# Altium project Compact Inverter Driver V5.PrjPcb (part 2 of 2)

## Sheet Voltage Sensor.SchDoc
size A4; SheetNumber: 7; SheetTotal: 9
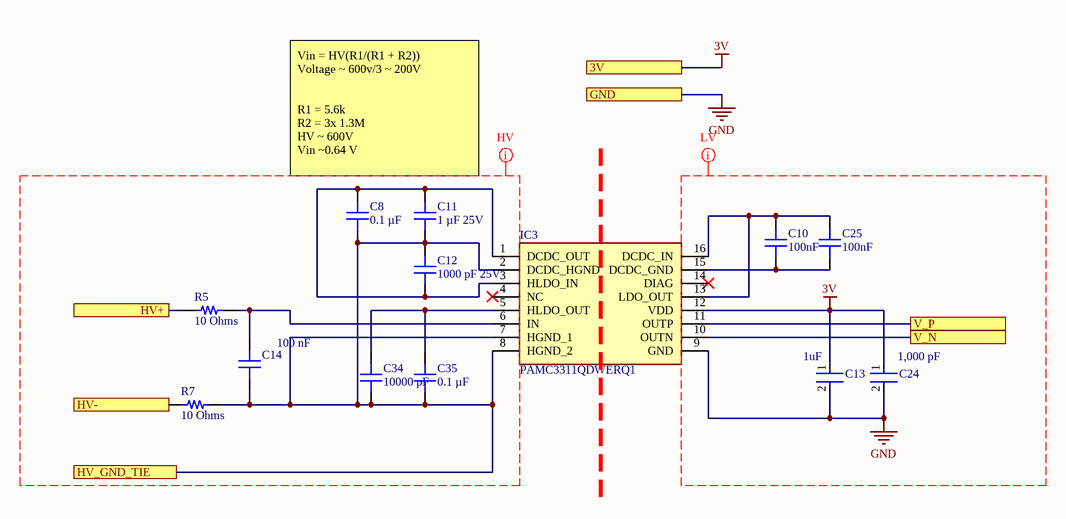
[diagram p6: Voltage Sensor.SchDoc]

### Parts
C8  0.1 µF  [CAP 0402_1005]
C10  100nF  [CAP 0402_1005]
C11  Capacitance: 1 µF 25V  [MURATA GRM155 0402_1005]  (hidden comment: 1 µF)
C12  Capacitance: 1000 pF 25V  [CAP 0402_1005]  (hidden comment: 1000 pF)
C13  Capacitance: 1uF  [FP-CGA3E-0_3-0_1-IPC_A]  (hidden comment: CGA3E1X7R1E105K080AC)
C14  100 nF  [CAP 0603_1608]
C24  Capacitance: 1,000 pF  [FP-C0603C-CF-MFG]  (hidden comment: C0603C102K5RACTU)
C25  100nF  [CAP 0402_1005]
C34  10000 pF  [CAP 0402_1005]
C35  0.1 µF  [CAP 0402_1005]
IC3  PAMC3311QDWERQ1  [SOIC127P1030X265-16N]
R5  10 Ohms  [RES 0402_1005]
R7  10 Ohms  [RES 0402_1005]

### Ports
3V, GND, HV+, HV-, HV_GND_TIE, V_N, V_P

### Nets
3V: C13.1 C24.1 IC3.12(VDD) ; port 3V
GND: C13.2 C24.2 IC3.9(GND) ; port GND
HV-: R7.1 ; port HV-
HV_SENSE: R5.1 ; port HV+
HV_TIE: C8.1 C11.1 C12.2 C14.1 C34.1 C35.1 IC3.2(DCDC_HGND) IC3.7(HGND_1) IC3.8(HGND_2) R7.2 ; port HV_GND_TIE
V_N: IC3.10(OUTN) ; port V_N
V_P: IC3.11(OUTP) ; port V_P
NetC8_2: C8.2 C11.2 C12.1 IC3.1(DCDC_OUT) IC3.3(HLDO_IN)
NetC10_1: C10.1 C25.1 IC3.15(DCDC_GND)
NetC10_2: C10.2 C25.2 IC3.13(LDO_OUT) IC3.16(DCDC_IN)
NetC14_2: C14.2 IC3.6(IN) R5.2
NetC34_2: C34.2 C35.2 IC3.5(HLDO_OUT)

Not connected (* = marked no-connect by the designer): IC3 4(NC)* 14(DIAG)*

### Layout directives
net class HV: (no net found under the mark)
net class LV: 3V, GND

### Notes on the sheet
- Vin = HV(R1/(R1 + R2))
  Voltage ~ 600v/3 ~ 200V
  R1 = 5.6k
  R2 = 3x 1.3M
  HV ~ 600V
  Vin ~0.64 V
  VinMax = +- 2v
  Vout = ~6.4v
- MY
- 25
- Project:
- Author
- Revision
- Sheet
- Modified
- of

### Library data of the parts
C8 C35 = C0402C104K4RECAUTO: CAP CER 0402 0.1UF 16V X7R 10%; manufacturer: KEMET; Part Number: C0402C104K4RECAUTO; Capacitance: 0.1 µF; Applications: Automotive, ESD Protection; componentlink1description: Datasheet; componentlink1url: https://api.kemet.com/component-edge/download/datasheet/C0402C104K4RECAUTO.pdf; componentlink2description: DigiKey Link; componentlink2url: https://www.digikey.com/en/products/detail/kemet/C0402C104K4RECAUTO/8563695; Device Package: 0402 (1005 Metric); lastupdated: 2/9/2024 8:04:38 PM; Lifecycle Status: Active; Minimum Order: 1; Mounting Type: Surface Mount, MLCC; Operating Temperature: -55°C ~ 125°C; Package / Case: 0402 (1005 Metric); packaging: TapeAndReel; partid: 1731; Part Status: Active; price: 0.01; Ratings: AEC-Q200; series: ESD SMD Auto X7R; Size / Dimension: 0.039" L x 0.020" W (1.00mm x 0.50mm); Supplier 1: DigiKey; Supplier Part Number 1: 399-17167-1-ND; Temperature Coefficient: X7R; Thickness (Max): 0.022" (0.55mm); Tolerance: ±10%; value: 0.1 µF; Voltage - Rated: 16V
C10 C25 = ZRB157R61E225KE11D: CAP CER 2.2UF 25V X5R 0402; manufacturer: Murata Electronics; Capacitance: 2.2 µF; Tolerance: ±10%; value: 2.2 µF; Part Number: ZRB157R61E225KE11D; Applications: Acoustic Noise Reduction; componentlink1description: Datasheet; componentlink1url: https://search.murata.co.jp/Ceramy/image/img/A01X/G101/ENG/ZRB157R61E225KE11-01.pdf; componentlink2description: DigiKey Link; componentlink2url: https://www.digikey.com/en/products/detail/murata-electronics/ZRB157R61E225KE11D/5321074; Device Package: 0402 (1005 Metric); Features: Interposer Termination; lastupdated: 2/9/2024 8:04:27 PM; Lifecycle Status: Active; Minimum Order: 1; Mounting Type: Surface Mount, MLCC; Operating Temperature: -55°C ~ 85°C; Package / Case: 0402 (1005 Metric); packaging: TapeAndReel; partid: 8590; Part Status: Active; price: 0.04; series: ZRB; Size / Dimension: 0.039" L x 0.020" W (1.00mm x 0.50mm); Supplier 1: DigiKey; Supplier Part Number 1: 490-10982-1-ND; Temperature Coefficient: X5R; Thickness (Max): 0.033" (0.85mm); Voltage - Rated: 25V
C11 = GRM155C71A105KE11D: CAP CER 1UF 10V X7S 0402; manufacturer: Murata Electronics; Tolerance: ±10%; Part Number: GRM155C71A105KE11D; Applications: General Purpose; componentlink1description: Datasheet; componentlink1url: https://search.murata.co.jp/Ceramy/image/img/A01X/G101/ENG/GRM155C71A105KE11-01.pdf; componentlink2description: DigiKey Link; componentlink2url: https://www.digikey.com/en/products/detail/murata-electronics/GRM155C71A105KE11D/6606086; Device Package: 0402 (1005 Metric); lastupdated: 7/23/2025 10:42:36 AM; Lifecycle Status: Active; Minimum Order: 1; Mounting Type: Surface Mount, MLCC; Operating Temperature: -55°C ~ 125°C; Package / Case: 0402 (1005 Metric); packaging: TapeAndReel; partid: 1749; Part Status: Active; price: 0.01; series: GRM; Size / Dimension: 0.039" L x 0.020" W (1.00mm x 0.50mm); Supplier 1: DigiKey; Supplier Part Number 1: 490-14457-1-ND; Temperature Coefficient: X7S; Thickness (Max): 0.024" (0.60mm); value: 1 µF; Voltage - Rated: 10V
C12 = UMK105CG102JVHF: CAP CER 1000PF 50V C0G/NP0 0402; manufacturer: Taiyo Yuden; Temperature Coefficient: C0G, NP0; Tolerance: ±5%; Part Number: UMK105CG102JVHF; Applications: Automotive; componentlink1description: Datasheet; componentlink1url: https://ds.yuden.co.jp/TYCOMPAS/ut/detail?pn=UMK105CG102JVHF &u=M; componentlink2description: DigiKey Link; componentlink2url: https://www.digikey.com/en/products/detail/taiyo-yuden/UMK105CG102JVHF/4811103; Device Package: 0402 (1005 Metric); lastupdated: 2/9/2024 8:04:38 PM; Lifecycle Status: Active; Minimum Order: 1; Mounting Type: Surface Mount, MLCC; Operating Temperature: -55°C ~ 125°C; Package / Case: 0402 (1005 Metric); packaging: TapeAndReel; partid: 1779; Part Status: Active; price: 0.01; Ratings: AEC-Q200; series: M; Size / Dimension: 0.039" L x 0.020" W (1.00mm x 0.50mm); Supplier 1: DigiKey; Supplier Part Number 1: 587-3737-1-ND; Thickness (Max): 0.022" (0.55mm); value: 1000 pF; Voltage - Rated: 50V
C13 = CMP-08246-001507-1: Cap Ceramic 1uF 25V X7R 10% Pad SMD 0603 +125°C Automotive T/R; Dielectric: X7R; Voltage Rating: 25V; Thickness: 0.035inch; Width: 0.031inch; Ratings: AEC-Q200; Case Code (Metric): 1608; REACH SVHC: No SVHC; Voltage: 25V; Composition: Ceramic; Min Operating Temperature: -55°C; Termination: SMD/SMT; Depth: 0.8mm; Max Operating Temperature: 125°C; Mount: Surface Mount; Weight: 7.1E-05oz; Package Quantity: 4000; Tolerance: 10%; Packaging: Tape and Reel; Lead Free: Lead Free; Case/Package: 0603; Length: 1.6mm; Height: 0.8mm; Case Code (Imperial): 0603; Voltage Rating (DC): 25V
C14 = VJ0603Y104MXQCW1BC: manufacturer: Vishay Vitramon; Capacitance: 0.1 µF; Temperature Coefficient: X7R; Tolerance: ±20%; value: 0.1 µF; Voltage - Rated: 10V; Part Number: VJ0603Y104MXQCW1BC; Applications: General Purpose; componentlink1description: Datasheet; componentlink1url: https://www.vishay.com/docs/28548/vjw1bcbascomseries.pdf; componentlink2description: DigiKey Link; componentlink2url: https://www.digikey.com/en/products/detail/vishay-vitramon/VJ0603Y104MXQCW1BC/8305323; Device Package: 0603 (1608 Metric); lastupdated: 2/9/2024 8:09:54 PM; Lifecycle Status: Active; Minimum Order: 1; Mounting Type: Surface Mount, MLCC; Operating Temperature: -55°C ~ 125°C; Package / Case: 0603 (1608 Metric); packaging: TapeAndReel; partid: 34594; Part Status: Active; price: 0.01; series: VJ W1BC; Size / Dimension: 0.063" L x 0.031" W (1.60mm x 0.80mm); Supplier 1: DigiKey; Supplier Part Number 1: 720-VJ0603Y104MXQCW1BCCT-ND; Thickness (Max): 0.034" (0.87mm)
C24 = CMP-2006-03022-3: CAP CER 1000PF 50V X7R 0603; Manufacturer: KEMET; Automotive Grade: Grade 1; Tolerance: 0.1; Value: 1,000 pF; Temperature Coefficient: 30ppm/°C; Material: Ceramic; Temperature Characteristic: X7R; ComponentLink2URL: https://api.kemet.com/component-edge/download/datasheet/C0603C100J5GACAUTO.pdf; Temperature Range Low: -55°C; Device Class L2: Capacitors; Device Class L3: Ceramic Capacitors; Device Class L1: Passive Components; Temperature Range High: +125°C; Manufacturer Part Number: C0603C102K5RACTU; Digikey Description: CAP CER 1000PF 50V X7R 0603; Temperature: -55°C to +125°C; Voltage Rating: 50 V; Mouser Description: Capacitor; Ceramic; Cap; 1000pF; Tol 10%; SMT; Vol-Rtg 50V; X7R; Tape and Reel; Automotive: Yes; RoHS: TRUE; Octopart: https://octopart.com/c0603c102k5ractu-kemet-144878; Height: 0.87mm; Package: C0603C-CF; Lead Free: Yes; Category: Cap; ComponentLink2Description: Datasheet
C34 = TMK105BJ103KP-F: CAP CER 10000PF 25V X5R 0402; manufacturer: Taiyo Yuden; Tolerance: ±10%; Part Number: TMK105BJ103KP-F; Capacitance: 10000 pF; Applications: SMPS Filtering; componentlink1description: Datasheet; componentlink1url: https://ds.yuden.co.jp/TYCOMPAS/ut/detail?pn=TMK105BJ103KP-F  &u=M; componentlink2description: DigiKey Link; componentlink2url: https://www.digikey.com/en/products/detail/taiyo-yuden/TMK105BJ103KP-F/5182051; Device Package: 0402 (1005 Metric); lastupdated: 2/9/2024 8:04:38 PM; Lifecycle Status: Active; Minimum Order: 1; Mounting Type: Surface Mount, MLCC; Operating Temperature: -55°C ~ 85°C; Package / Case: 0402 (1005 Metric); packaging: TapeAndReel; partid: 1788; Part Status: Active; price: 0.01; series: M; Size / Dimension: 0.039" L x 0.020" W (1.00mm x 0.50mm); Supplier 1: DigiKey; Supplier Part Number 1: 587-5593-1-ND; Temperature Coefficient: X5R; Thickness (Max): 0.022" (0.55mm); value: 10000 pF; Voltage - Rated: 25V
IC3 = PAMC3311QDWERQ1: Integrated Circuit; Manufacturer_Name: Texas Instruments; Datasheet Link: https://www.ti.com/lit/gpn/amc3311-q1?HQS=ti-null-null-sf-df-pf-sep-wwe&DCM=yes?hkey=EF798316E3902B6ED9A73243A3159BB0; Height: 2.65mm; Manufacturer_Part_Number: PAMC3311QDWERQ1
R5 R7 = WR04X100 JTL: RES 10 OHM 5% 1/16W 0402; Manufacturer: Walsin Technology Corporation; Power (Watts): 0.063W, 1/16W; Temperature Coefficient: -200/ +400ppm/°C; Part Number: WR04X100 JTL; Value: 10 Ohms; ComponentLink1Description: Datasheet; ComponentLink1URL: https://www.passivecomponent.com/wp-content/uploads/chipR/ASC_WR.pdf; ComponentLink2Description: DigiKey Link; ComponentLink2URL: https://www.digikey.com/en/products/detail/walsin-technology-corporation/WR04X100-JTL/13241174; Composition: Thick Film; Device Package: 0402 (1005 Metric); Height - Seated (Max): 0.016" (0.40mm); LastUpdated: 2/9/2024 8:28:55 PM; Lifecycle Status: Active; Minimum Order: 1; Number of Terminations: 2; Operating Temperature: -55°C ~ 155°C; Package / Case: 0402 (1005 Metric); Packaging: CutTape; PartId: 64776; Part Status: Active; Price: 0.01; Resistance: 10 Ohms; Series: WR; Size / Dimension: 0.039" L x 0.020" W (1.00mm x 0.50mm); Supplier 1: DigiKey; Supplier Part Number 1: 1292-WR04X100JTLCT-ND; Supplier Device Package: 0402; Tolerance: ±5%

## Sheet LED.SchDoc
size A; SheetNumber: 9; SheetTotal: 9
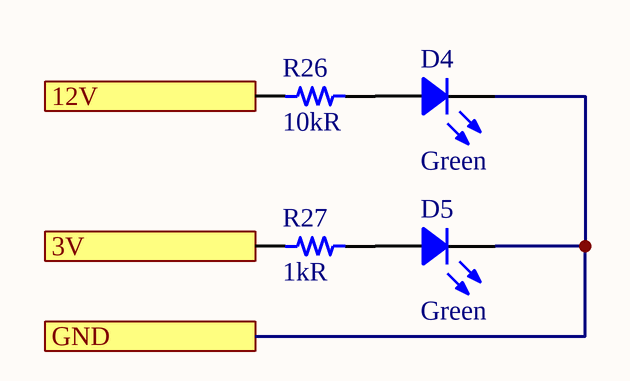
[diagram p7: LED.SchDoc]

### Parts
D4  Green  [LED 0603_1608 GREEN]
D5  Green  [LED 0603_1608 GREEN]
R26  10kR  [RES 0402_1005]
R27  1kR  [RES 0402_1005]

### Ports
3V, 12V, GND

### Nets
3V: R27.2 ; port 3V
12V: R26.2 ; port 12V
GND: D4.2 D5.2 ; port GND
NetD4_1: D4.1 R26.1
NetD5_1: D5.1 R27.1

### Library data of the parts
D4 D5 = SECU1413C-TG20: GREEN, D=564NM, IV=75MCD; Manufacturer: Sanken; Current - Test: 20mA; Lens Size: 0.92mm Dia; Lens Style: Round with Domed Top; Millicandela Rating: 75mcd; Viewing Angle: 60°; Voltage - Forward (Vf) (Typ): 2.1V; Wavelength - Dominant: 564nm; Part Number: SECU1413C-TG20; Color: Green; ComponentLink1Description: Datasheet; ComponentLink1URL: https://www.semicon.sanken-ele.co.jp/sk_content/secu1413c-tg20_ds_en.pdf; ComponentLink2Description: DigiKey Link; ComponentLink2URL: https://www.digikey.com/en/products/detail/sanken/SECU1413C-TG20/16639358; Device Package: 0603 (1608 Metric); Height (Max): 1.48mm; LastUpdated: 6/3/2024 7:58:48 PM; Lifecycle Status: Active; Minimum Order: 1; Mounting Type: Surface Mount; Package / Case: 0603 (1608 Metric); Packaging: CutTape; PartId: 1166; Part Status: Active; Price: 0.28; Series: -; Size / Dimension: 1.60mm L x 0.80mm W; Supplier 1: DigiKey; Supplier Part Number 1: 1261-SECU1413C-TG20TR-ND; Supplier Device Package: 0603; Value: Green
R26 R27 = RP73PF1E249KBTD: RES 249K OHM 0.1% 1/10W 0402; Manufacturer: TE Connectivity Passive Product; Value: 249 kOhms; Power (Watts): 0.1W, 1/10W; Temperature Coefficient: ±25ppm/°C; Part Number: RP73PF1E249KBTD; ComponentLink1Description: Datasheet; ComponentLink1URL: https://www.te.com/commerce/DocumentDelivery/DDEController?Action=srchrtrv&DocNm=1773272&DocType=DS&DocLang=English; ComponentLink2Description: DigiKey Link; ComponentLink2URL: https://www.digikey.com/en/products/detail/te-connectivity-passive-product/RP73PF1E249KBTD/8261091; Composition: Thin Film; Device Package: 0402 (1005 Metric); Height - Seated (Max): 0.014" (0.35mm); LastUpdated: 2/9/2024 8:30:24 PM; Lifecycle Status: Active; Minimum Order: 1; Number of Terminations: 2; Operating Temperature: -55°C ~ 155°C; Package / Case: 0402 (1005 Metric); Packaging: TapeAndReel; PartId: 2418; Part Status: Active; Price: 0.07; Resistance: 249 kOhms; Series: RP73, Holsworthy; Size / Dimension: 0.039" L x 0.020" W (1.00mm x 0.50mm); Supplier 1: DigiKey; Supplier Part Number 1: A127549CT-ND; Supplier Device Package: 0402; Tolerance: ±0.1%

## Nets that join several sheets
3V: U_DriverA (C9_U_DriverA.2 IC2_U_DriverA.3 IC2_U_DriverA.8 U1_U_DriverA.5), U_Bias_HighA (C1_U_Bias_HighA.2 R1_U_Bias_HighA.2 R22_U_Bias_HighA.1), U_HallConnectorA (J1_U_HallConnectorA.4 R18_U_HallConnectorA.1), Output Connector (6 pins), U_DriverB (C9_U_DriverB.2 IC2_U_DriverB.3 IC2_U_DriverB.8 U1_U_DriverB.5), U_Bias_HighB (C1_U_Bias_HighB.2 R1_U_Bias_HighB.2 R22_U_Bias_HighB.1), U_HallConnectorB (J1_U_HallConnectorB.4 R18_U_HallConnectorB.1), U_DriverC (C9_U_DriverC.2 IC2_U_DriverC.3 IC2_U_DriverC.8 U1_U_DriverC.5), U_Bias_HighC (C1_U_Bias_HighC.2 R1_U_Bias_HighC.2 R22_U_Bias_HighC.1), U_HallConnectorC (J1_U_HallConnectorC.4 R18_U_HallConnectorC.1), Voltage Sensor (C13.1 C24.1 IC3.12), LED (R27.2)
12V: U_Bias_HighA (5 pins), Output Connector (J3.25 J3.27), U_Bias_HighB (5 pins), U_Bias_HighC (5 pins), LED (R26.2)
GND: Tree (10 pins), U_DriverA (8 pins), U_Bias_HighA (18 pins), U_HallConnectorA (J1_U_HallConnectorA.1), Output Connector (13 pins), U_DriverB (8 pins), U_Bias_HighB (18 pins), U_HallConnectorB (J1_U_HallConnectorB.1), U_DriverC (8 pins), U_Bias_HighC (18 pins), U_HallConnectorC (J1_U_HallConnectorC.1), Voltage Sensor (C13.2 C24.2 IC3.9), LED (D4.2 D5.2)
FAULT: U_Bias_HighA (IC1_U_Bias_HighA.3 R22_U_Bias_HighA.2), Output Connector (R19.1)
FAULT: Output Connector (R21.1), U_Bias_HighC (IC1_U_Bias_HighC.3 R22_U_Bias_HighC.2)
FAULT: Output Connector (R20.1), U_Bias_HighB (IC1_U_Bias_HighB.3 R22_U_Bias_HighB.2)
HV-: Voltage Sensor (R7.1), U_Gate Connector (J2_U_Gate_Connector.01)
HV_SENSE: Voltage Sensor (R5.1), U_Gate Connector (J2_U_Gate_Connector.02)
HV_TIE: U_DriverC (C19_U_DriverC.2 C21_U_DriverC.1 IC2_U_DriverC.9 R16_U_DriverC.2), U_Bias_HighC (18 pins), U_Gate ConnectorCB (J2_U_Gate_ConnectorCB.01), Voltage Sensor (10 pins)
J+: U_DriverA (D3_U_DriverA.2 R16_U_DriverA.1 R17_U_DriverA.2), U_Gate ConnectorAB (J2_U_Gate_ConnectorAB.02)
J+: U_DriverA (D2_U_DriverA.2 R4_U_DriverA.1 R9_U_DriverA.2), U_Gate ConnectorAA (J2_U_Gate_ConnectorAA.02)
J+: U_DriverB (D3_U_DriverB.2 R16_U_DriverB.1 R17_U_DriverB.2), U_Gate ConnectorBB (J2_U_Gate_ConnectorBB.02)
J+: U_DriverB (D2_U_DriverB.2 R4_U_DriverB.1 R9_U_DriverB.2), U_Gate ConnectorBA (J2_U_Gate_ConnectorBA.02)
J+: U_DriverC (D3_U_DriverC.2 R16_U_DriverC.1 R17_U_DriverC.2), U_Gate ConnectorCB (J2_U_Gate_ConnectorCB.02)
J+: U_DriverC (D2_U_DriverC.2 R4_U_DriverC.1 R9_U_DriverC.2), U_Gate ConnectorCA (J2_U_Gate_ConnectorCA.02)
J-: U_DriverA (C19_U_DriverA.2 C21_U_DriverA.1 IC2_U_DriverA.9 R16_U_DriverA.2), U_Bias_HighA (18 pins), U_Gate ConnectorAB (J2_U_Gate_ConnectorAB.01)
J-: U_DriverA (C18_U_DriverA.1 IC2_U_DriverA.14 R4_U_DriverA.2), U_Gate ConnectorAA (J2_U_Gate_ConnectorAA.01)
J-: U_DriverB (C19_U_DriverB.2 C21_U_DriverB.1 IC2_U_DriverB.9 R16_U_DriverB.2), U_Bias_HighB (18 pins), U_Gate ConnectorBB (J2_U_Gate_ConnectorBB.01)
J-: U_DriverB (C18_U_DriverB.1 IC2_U_DriverB.14 R4_U_DriverB.2), U_Gate ConnectorBA (J2_U_Gate_ConnectorBA.01)
J-: U_DriverC (C18_U_DriverC.1 IC2_U_DriverC.14 R4_U_DriverC.2), U_Gate ConnectorCA (J2_U_Gate_ConnectorCA.01)
NetJ1_U_HallConnectorA_2: U_DriverA (R13_U_DriverA.1), U_HallConnectorA (J1_U_HallConnectorA.2), Output Connector (J3.38)
NetJ1_U_HallConnectorA_3: U_HallConnectorA (J1_U_HallConnectorA.3), Output Connector (J3.36)
NetJ1_U_HallConnectorA_6: U_HallConnectorA (J1_U_HallConnectorA.6), Output Connector (J3.40)
NetJ1_U_HallConnectorA_8: U_HallConnectorA (J1_U_HallConnectorA.8 R18_U_HallConnectorA.2), Output Connector (J3.28)
NetJ1_U_HallConnectorB_2: Output Connector (J3.10), U_DriverB (R13_U_DriverB.1), U_HallConnectorB (J1_U_HallConnectorB.2)
NetJ1_U_HallConnectorB_3: Output Connector (J3.12), U_HallConnectorB (J1_U_HallConnectorB.3)
NetJ1_U_HallConnectorB_6: Output Connector (J3.08), U_HallConnectorB (J1_U_HallConnectorB.6)
NetJ1_U_HallConnectorB_8: Output Connector (J3.14), U_HallConnectorB (J1_U_HallConnectorB.8 R18_U_HallConnectorB.2)
NetJ1_U_HallConnectorC_2: Output Connector (J3.03), U_DriverC (R13_U_DriverC.1), U_HallConnectorC (J1_U_HallConnectorC.2)
NetJ1_U_HallConnectorC_3: Output Connector (J3.01), U_HallConnectorC (J1_U_HallConnectorC.3)
NetJ1_U_HallConnectorC_6: Output Connector (J3.05), U_HallConnectorC (J1_U_HallConnectorC.6)
NetJ1_U_HallConnectorC_8: Output Connector (J3.13), U_HallConnectorC (J1_U_HallConnectorC.8 R18_U_HallConnectorC.2)
NetJ3_02: Output Connector (J3.02), U_DriverB (R10_U_DriverB.1)
NetJ3_04: Output Connector (J3.04), U_DriverB (R11_U_DriverB.1)
NetJ3_06: Output Connector (J3.06), U_DriverB (R12_U_DriverB.1)
NetJ3_07: Output Connector (J3.07), U_DriverC (R12_U_DriverC.1)
NetJ3_09: Output Connector (J3.09), U_DriverC (R11_U_DriverC.1)
NetJ3_11: Output Connector (J3.11), U_DriverC (R10_U_DriverC.1)
NetJ3_30: U_DriverA (R10_U_DriverA.1), Output Connector (J3.30)
NetJ3_32: U_DriverA (R11_U_DriverA.1), Output Connector (J3.32)
NetJ3_34: U_DriverA (R12_U_DriverA.1), Output Connector (J3.34)
V_N: Output Connector (J3.37), Voltage Sensor (IC3.10)
V_P: Output Connector (J3.39), Voltage Sensor (IC3.11)
VCC: U_DriverA (C19_U_DriverA.1 C21_U_DriverA.2 IC2_U_DriverA.11 R8_U_DriverA.1), U_Bias_HighA (6 pins)
VCC: U_DriverB (C19_U_DriverB.1 C21_U_DriverB.2 IC2_U_DriverB.11 R8_U_DriverB.1), U_Bias_HighB (6 pins)
VCC: U_DriverC (C19_U_DriverC.1 C21_U_DriverC.2 IC2_U_DriverC.11 R8_U_DriverC.1), U_Bias_HighC (6 pins)